# Altium schematic sheet ManipulatorControlPartSCH.SchDoc
size A3; SheetNumber: 3; SheetTotal: 3
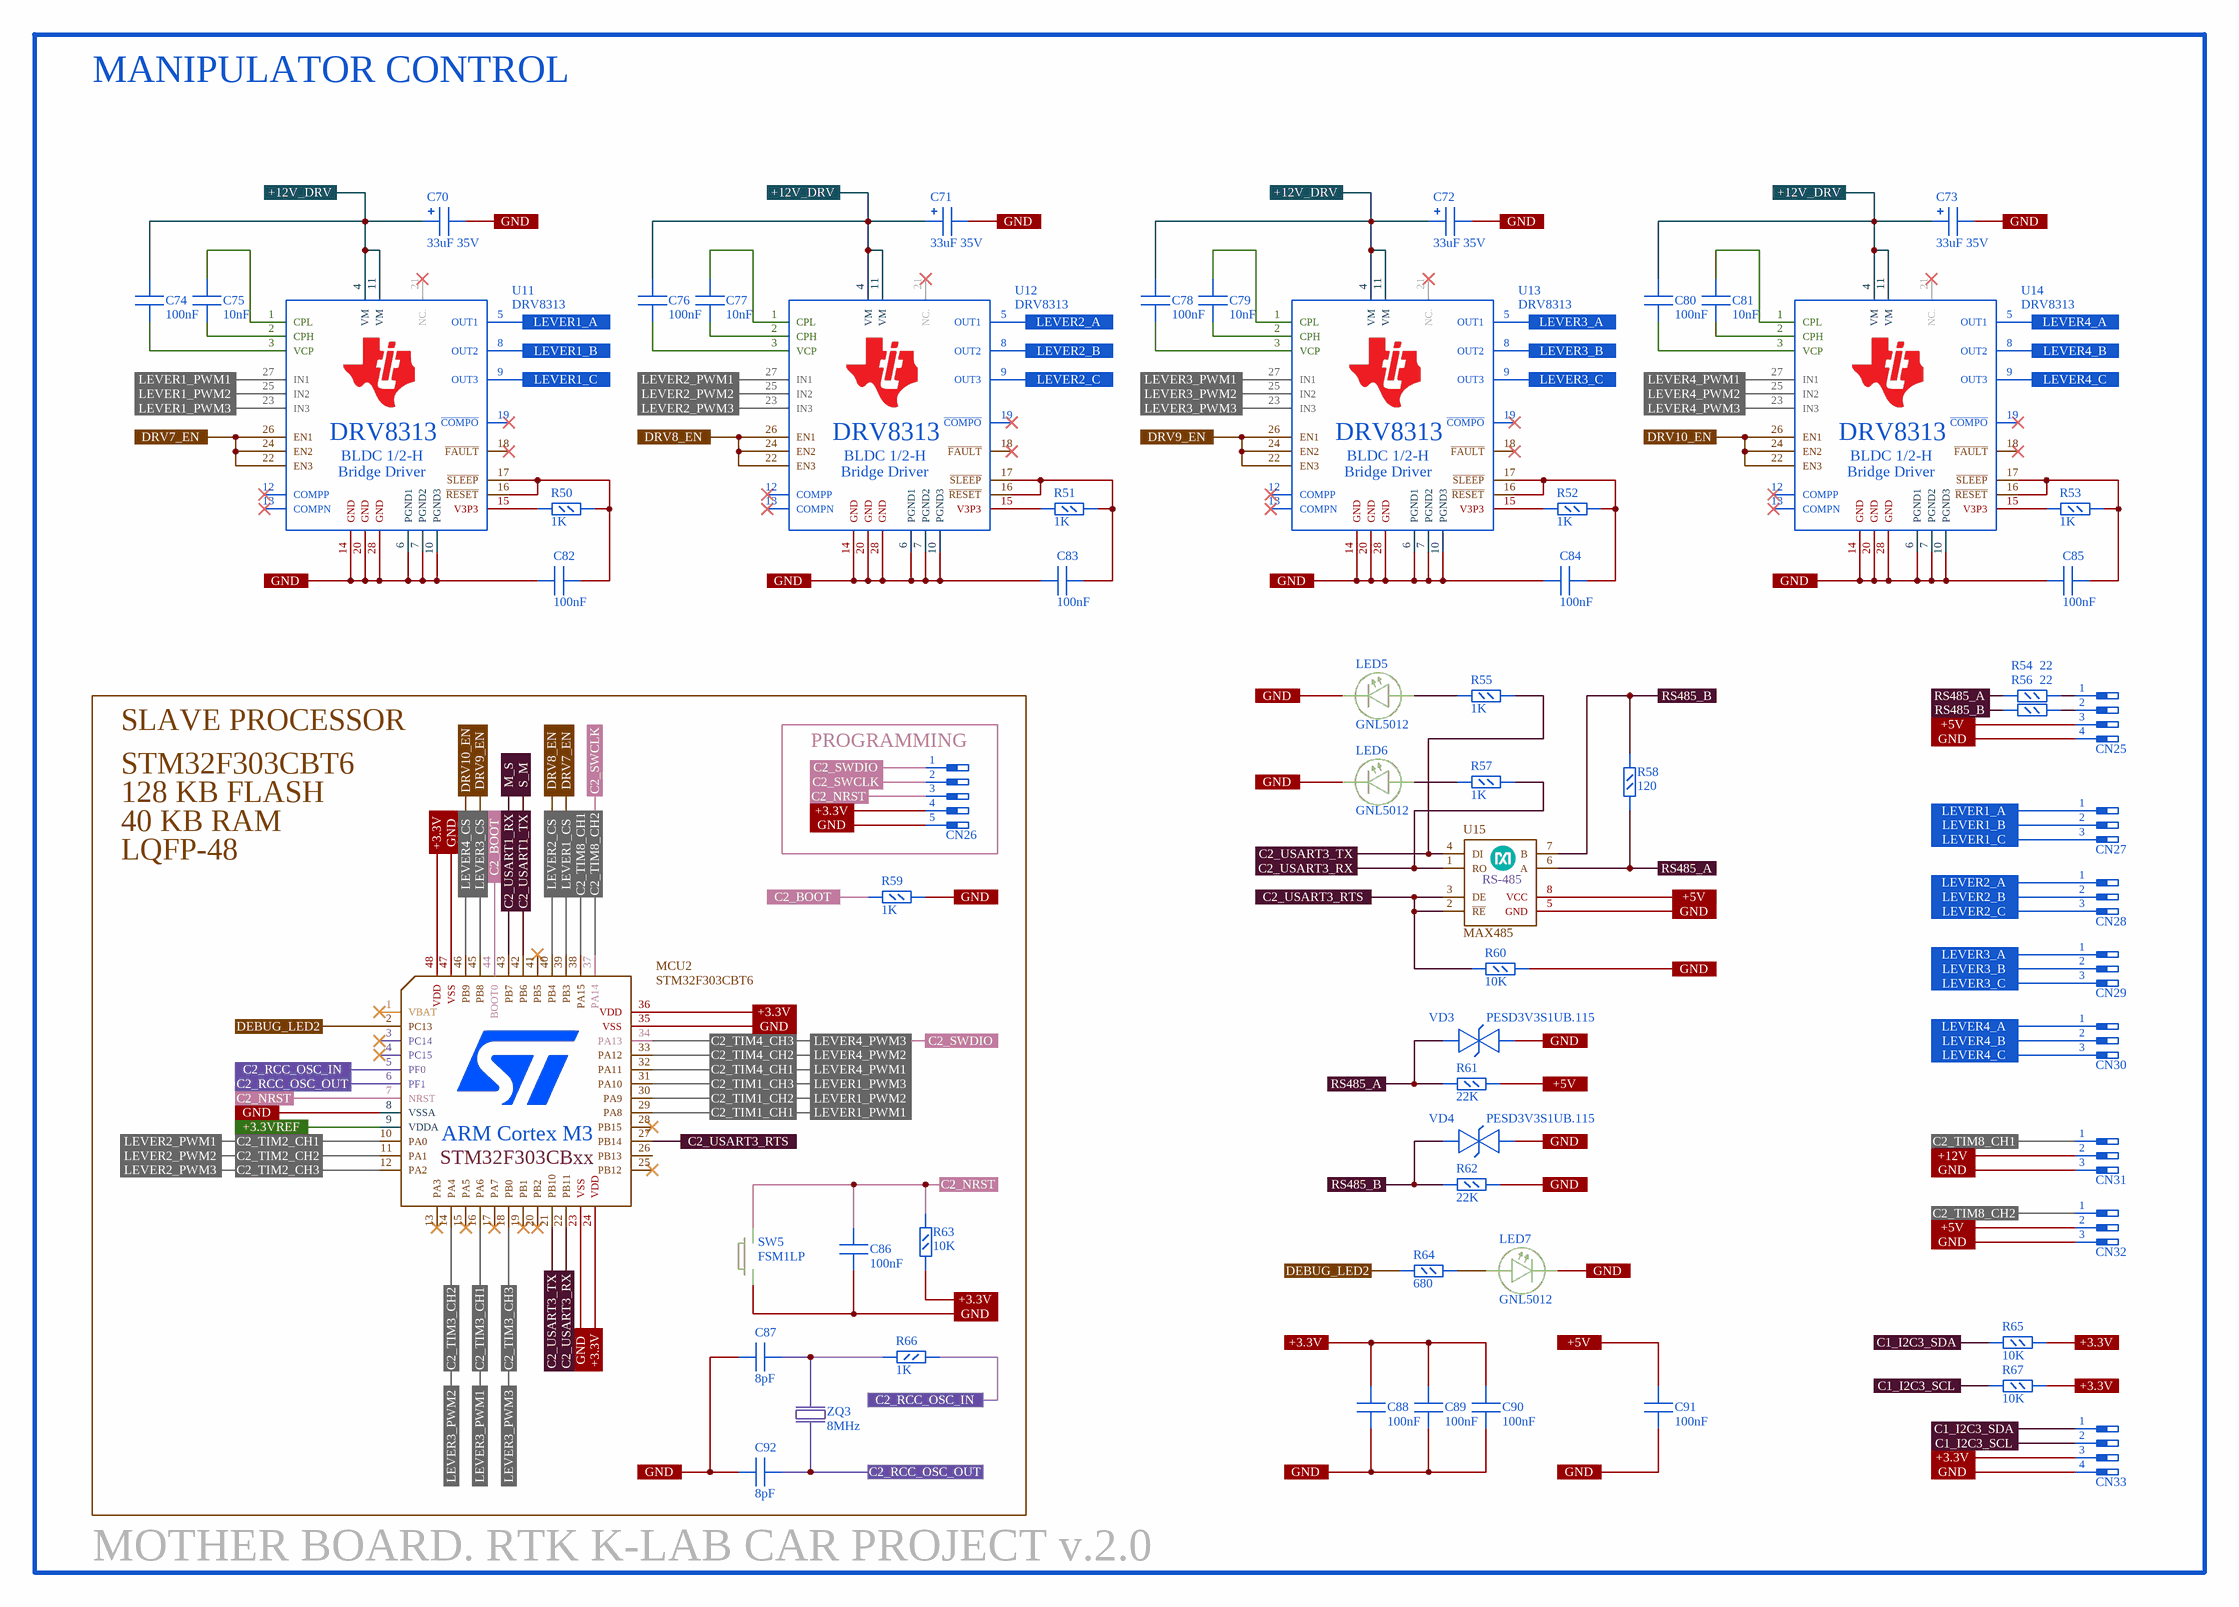
[diagram p0: ManipulatorControlPartSCH.SchDoc]

## Parts
C70  33uF 35V  [CAP_TAN-B]
C71  33uF 35V  [CAP_TAN-B]
C72  33uF 35V  [CAP_TAN-B]
C73  33uF 35V  [CAP_TAN-B]
C74  100nF  [C0603]
C75  10nF  [C0603]
C76  100nF  [C0603]
C77  10nF  [C0603]
C78  100nF  [C0603]
C79  10nF  [C0603]
C80  100nF  [C0603]
C81  10nF  [C0603]
C82  100nF  [C0603]
C83  100nF  [C0603]
C84  100nF  [C0603]
C85  100nF  [C0603]
C86  100nF  [C0603]
C87  8pF  [C0402]
C88  100nF  [C0603]
C89  100nF  [C0603]
C90  100nF  [C0603]
C91  100nF  [C0603]
C92  8pF  [C0402]
CN25  1x04  [XH2.54-4PIN]  (value not drawn)
CN26  1x05  [5X1M]  (value not drawn)
CN27  1x03  [H3-5.08]  (value not drawn)
CN28  1x03  [H3-5.08]  (value not drawn)
CN29  1x03  [H3-5.08]  (value not drawn)
CN30  1x03  [H3-5.08]  (value not drawn)
CN31  1x03  [3X1F-H8MM]  (value not drawn)
CN32  1x03  [3X1F-H8MM]  (value not drawn)
CN33  1x04  [XH2.54-4PIN]  (value not drawn)
LED5  GNL5012  [LED0603]
LED6  GNL5012  [LED0603]
LED7  GNL5012  [LED0603]
MCU2  STM32F303CBT6  [LQFP48]
R50  1K  [R0603]
R51  1K  [R0603]
R52  1K  [R0603]
R53  1K  [R0603]
R54  22  [R0805]
R55  1K  [R0603]
R56  22  [R0805]
R57  1K  [R0603]
R58  120  [R0603]
R59  1K  [R0603]
R60  10K  [R0603]
R61  22K  [R0603]
R62  22K  [R0603]
R63  10K  [R0603]
R64  680  [R0603]
R65  10K  [R0603]
R66  1K  [R0603]
R67  10K  [R0603]
SW5  FSM1LP  [BUT-SMD-8X6.2MM]
U11  DRV8313  [TSSOP28-TP]
U12  DRV8313  [TSSOP28-TP]
U13  DRV8313  [TSSOP28-TP]
U14  DRV8313  [TSSOP28-TP]
U15  MAX485  [SOIC8]
VD3  PESD3V3S1UB.115  [SOD-323]
VD4  PESD3V3S1UB.115  [SOD-323]
ZQ3  8MHz  [NX5032GA]

## Blocks framed on the sheet
PROGRAMMING: CN26

## Ports
+3.3V, +3.3VREF, +5V, +12V, +12V_DRV, C1_I2C3_SCL, C1_I2C3_SDA, C2_BOOT, C2_NRST, C2_RCC_OSC_IN, C2_RCC_OSC_OUT, C2_SWCLK, C2_SWDIO, C2_TIM1_CH1, C2_TIM1_CH2, C2_TIM1_CH3, C2_TIM2_CH1, C2_TIM2_CH2, C2_TIM2_CH3, C2_TIM3_CH1, C2_TIM3_CH2, C2_TIM3_CH3, C2_TIM4_CH1, C2_TIM4_CH2, C2_TIM4_CH3, C2_TIM8_CH1, C2_TIM8_CH2, C2_USART1_RX, C2_USART1_TX, C2_USART3_RTS, C2_USART3_RX, C2_USART3_TX, DEBUG_LED2, DRV7_EN, DRV8_EN, DRV9_EN, DRV10_EN, GND, LEVER1_A, LEVER1_B, LEVER1_C, LEVER1_CS, LEVER1_PWM1, LEVER1_PWM2, LEVER1_PWM3, LEVER2_A, LEVER2_B, LEVER2_C, LEVER2_CS, LEVER2_PWM1, LEVER2_PWM2, LEVER2_PWM3, LEVER3_A, LEVER3_B, LEVER3_C, LEVER3_CS, LEVER3_PWM1, LEVER3_PWM2, LEVER3_PWM3, LEVER4_A, LEVER4_B, LEVER4_C, LEVER4_CS, LEVER4_PWM1, LEVER4_PWM2, LEVER4_PWM3, M_S, RS485_A, RS485_B, S_M

## Nets
+3.3V: C88.2 C89.2 C90.2 CN26.4 CN33.3 MCU2.24(VDD) MCU2.36(VDD) MCU2.48(VDD) R63.2 R65.2 R67.2 ; port +3.3V
+3.3VREF: MCU2.9(VDDA) ; port +3.3VREF
+5V: C91.2 CN25.3 CN32.2 R61.1 U15.8(VCC) ; port +5V
+12V: CN31.2 ; port +12V
+12V_DRV: C70.1 C71.1 C72.1 C73.1 C74.2 C76.2 C78.2 C80.2 U11.4(VM) U11.11(VM) U12.4(VM) U12.11(VM) U13.4(VM) U13.11(VM) U14.4(VM) U14.11(VM) ; port +12V_DRV
C1_I2C3_SCL: CN33.2 R67.1 ; port C1_I2C3_SCL
C1_I2C3_SDA: CN33.1 R65.1 ; port C1_I2C3_SDA
C2_BOOT: MCU2.44(BOOT0) R59.2 ; port C2_BOOT
C2_NRST: C86.2 CN26.3 MCU2.7(NRST) R63.1 SW5.3(Q2) ; port C2_NRST
C2_RCC_OSC_IN: MCU2.5(PF0) R66.1 ; port C2_RCC_OSC_IN
C2_RCC_OSC_OUT: C92.1 MCU2.6(PF1) ZQ3.2 ; port C2_RCC_OSC_OUT
C2_SWCLK: CN26.2 CN32.1 MCU2.37(PA14) ; port C2_TIM8_CH2, port C2_SWCLK
C2_SWDIO: CN26.1 MCU2.34(PA13) U14.23(IN3) ; port LEVER4_PWM3, port C2_TIM4_CH3, port C2_SWDIO
C2_TIM1_CH1: MCU2.29(PA8) U11.27(IN1) ; port LEVER1_PWM1, port C2_TIM1_CH1
C2_TIM1_CH2: MCU2.30(PA9) U11.25(IN2) ; port LEVER1_PWM2, port C2_TIM1_CH2
C2_TIM1_CH3: MCU2.31(PA10) U11.23(IN3) ; port LEVER1_PWM3, port C2_TIM1_CH3
C2_TIM2_CH1: MCU2.10(PA0) U12.27(IN1) ; port LEVER2_PWM1, port C2_TIM2_CH1
C2_TIM2_CH2: MCU2.11(PA1) U12.25(IN2) ; port LEVER2_PWM2, port C2_TIM2_CH2
C2_TIM2_CH3: MCU2.12(PA2) U12.23(IN3) ; port LEVER2_PWM3, port C2_TIM2_CH3
C2_TIM3_CH1: MCU2.16(PA6) U13.27(IN1) ; port LEVER3_PWM1, port C2_TIM3_CH1
C2_TIM3_CH2: MCU2.14(PA4) U13.25(IN2) ; port LEVER3_PWM2, port C2_TIM3_CH2
C2_TIM3_CH3: MCU2.18(PB0) U13.23(IN3) ; port LEVER3_PWM3, port C2_TIM3_CH3
C2_TIM4_CH1: MCU2.32(PA11) U14.27(IN1) ; port LEVER4_PWM1, port C2_TIM4_CH1
C2_TIM4_CH2: MCU2.33(PA12) U14.25(IN2) ; port LEVER4_PWM2, port C2_TIM4_CH2
C2_TIM8_CH1: CN31.1 MCU2.38(PA15) ; port C2_TIM8_CH1
C2_USART1_RX: MCU2.43(PB7) ; port C2_USART1_RX, port M_S
C2_USART1_TX: MCU2.42(PB6) ; port C2_USART1_TX, port S_M
C2_USART3_RTS: MCU2.27(PB14) R60.2 U15.2(~{RE}) U15.3(DE) ; port C2_USART3_RTS
C2_USART3_RX: MCU2.22(PB11) R57.1 U15.1(RO) ; port C2_USART3_RX
C2_USART3_TX: MCU2.21(PB10) R55.1 U15.4(DI) ; port C2_USART3_TX
DEBUG_LED2: MCU2.2(PC13) R64.2 ; port DEBUG_LED2
DRV7_EN: MCU2.39(PB3) U11.22(EN3) U11.24(EN2) U11.26(EN1) ; port DRV7_EN, port LEVER1_CS
DRV8_EN: MCU2.40(PB4) U12.22(EN3) U12.24(EN2) U12.26(EN1) ; port DRV8_EN, port LEVER2_CS
DRV9_EN: MCU2.45(PB8) U13.22(EN3) U13.24(EN2) U13.26(EN1) ; port DRV9_EN, port LEVER3_CS
DRV10_EN: MCU2.46(PB9) U14.22(EN3) U14.24(EN2) U14.26(EN1) ; port DRV10_EN, port LEVER4_CS
GND: C70.2 C71.2 C72.2 C73.2 C82.1 C83.1 C84.1 C85.1 C86.1 C87.2 C88.1 C89.1 C90.1 C91.1 C92.2 CN25.4 CN26.5 CN31.3 CN32.3 CN33.4 LED5.2 LED6.2 LED7.2 MCU2.8(VSSA) MCU2.23(VSS) MCU2.35(VSS) MCU2.47(VSS) R59.1 R60.1 R62.1 SW5.1(Q1) U11.6(PGND1) U11.7(PGND2) U11.10(PGND3) U11.14(GND) U11.20(GND) U11.28(GND) U12.6(PGND1) U12.7(PGND2) U12.10(PGND3) U12.14(GND) U12.20(GND) U12.28(GND) U13.6(PGND1) U13.7(PGND2) U13.10(PGND3) U13.14(GND) U13.20(GND) U13.28(GND) U14.6(PGND1) U14.7(PGND2) U14.10(PGND3) U14.14(GND) U14.20(GND) U14.28(GND) U15.5(GND) VD3.2 VD4.2 ; port GND
LEVER1_A: CN27.1 U11.5(OUT1) ; port LEVER1_A
LEVER1_B: CN27.2 U11.8(OUT2) ; port LEVER1_B
LEVER1_C: CN27.3 U11.9(OUT3) ; port LEVER1_C
LEVER2_A: CN28.1 U12.5(OUT1) ; port LEVER2_A
LEVER2_B: CN28.2 U12.8(OUT2) ; port LEVER2_B
LEVER2_C: CN28.3 U12.9(OUT3) ; port LEVER2_C
LEVER3_A: CN29.1 U13.5(OUT1) ; port LEVER3_A
LEVER3_B: CN29.2 U13.8(OUT2) ; port LEVER3_B
LEVER3_C: CN29.3 U13.9(OUT3) ; port LEVER3_C
LEVER4_A: CN30.1 U14.5(OUT1) ; port LEVER4_A
LEVER4_B: CN30.2 U14.8(OUT2) ; port LEVER4_B
LEVER4_C: CN30.3 U14.9(OUT3) ; port LEVER4_C
RS485_A: R54.2 R58.1 R61.2 U15.6(A) VD3.1 ; port RS485_A
RS485_B: R56.2 R58.2 R62.2 U15.7(B) VD4.1 ; port RS485_B
NetC74_1: C74.1 U11.3(VCP)
NetC75_1: C75.1 U11.2(CPH)
NetC75_2: C75.2 U11.1(CPL)
NetC76_1: C76.1 U12.3(VCP)
NetC77_1: C77.1 U12.2(CPH)
NetC77_2: C77.2 U12.1(CPL)
NetC78_1: C78.1 U13.3(VCP)
NetC79_1: C79.1 U13.2(CPH)
NetC79_2: C79.2 U13.1(CPL)
NetC80_1: C80.1 U14.3(VCP)
NetC81_1: C81.1 U14.2(CPH)
NetC81_2: C81.2 U14.1(CPL)
NetC82_2: C82.2 R50.2 U11.16(~{RESET}) U11.17(~{SLEEP})
NetC83_2: C83.2 R51.2 U12.16(~{RESET}) U12.17(~{SLEEP})
NetC84_2: C84.2 R52.2 U13.16(~{RESET}) U13.17(~{SLEEP})
NetC85_2: C85.2 R53.2 U14.16(~{RESET}) U14.17(~{SLEEP})
NetC87_1: C87.1 R66.2 ZQ3.1
NetCN25_1: CN25.1 R54.1
NetCN25_2: CN25.2 R56.1
NetLED5_1: LED5.1 R55.2
NetLED6_1: LED6.1 R57.2
NetLED7_1: LED7.1 R64.1
NetR50_1: R50.1 U11.15(V3P3)
NetR51_1: R51.1 U12.15(V3P3)
NetR52_1: R52.1 U13.15(V3P3)
NetR53_1: R53.1 U14.15(V3P3)

Not connected (* = marked no-connect by the designer): MCU2 1(VBAT)* 3(PC14)* 4(PC15)* 13(PA3)* 15(PA5)* 17(PA7)* 19(PB1)* 20(PB2)* 25(PB12)* 26(PB13) 28(PB15)* 41(PB5)*; SW5 2(Q1) 4(Q2); U11 12(COMPP)* 13(COMPN)* 18(~{FAULT})* 19(~{COMPO})* 21(NC.)*; U12 12(COMPP)* 13(COMPN)* 18(~{FAULT})* 19(~{COMPO})* 21(NC.)*; U13 12(COMPP)* 13(COMPN)* 18(~{FAULT})* 19(~{COMPO})* 21(NC.)*; U14 12(COMPP)* 13(COMPN)* 18(~{FAULT})* 19(~{COMPO})* 21(NC.)*

## Notes on the sheet
- MANIPULATOR CONTROL
- SLAVE PROCESSOR
- STM32F303CBT6
- 128 KB FLASH
- 40 KB RAM
- LQFP-48
- (near C92) MOTHER BOARD. RTK K-LAB CAR PROJECT v.2.0
- (in symbol DRV8313) BLDC 1/2-H; Bridge Driver
- (in symbol MAX485) RS-485
- (in symbol STM32F303CBxx) ARM Cortex M3

## Library data of the parts
C70-C73 = Cap_Pol: Value: 33uF 35V
C74-C92 = Cap
  C74 C76 C78 C80 C82-C86 C88-C91: Value: 100nF
  C75 C77 C79 C81: Value: 10nF
  C87 C92: Value: 8pF
LED5-LED7 = LED: Name: GNL5012
MCU2 = STM32F303CBxx: Frequency: 72 MHZ; Flash: 128 kBytes; RAM: 40 kBytes; Name: STM32F303CBT6
R50-R67 = Res
  R50-R53 R55 R57 R59 R66: Value: 1K
  R54 R56: Value: 22
  R58: Value: 120
  R60 R63 R65 R67: Value: 10K
  R61 R62: Value: 22K
  R64: Value: 680
SW5 = Button: Name: FSM1LP
U15 = MAX485: Driver RS-485; Name: MAX485
VD3 VD4 = Suppressor: Value: 5.2V; Name: PESD3V3S1UB.115
ZQ3 = Crystall: Value: 8MHz; Name: NX5032GA
U11-U14 = DRV8313: Name: DRV8313